# Altium schematic sheet MCU.SchDoc
size A3
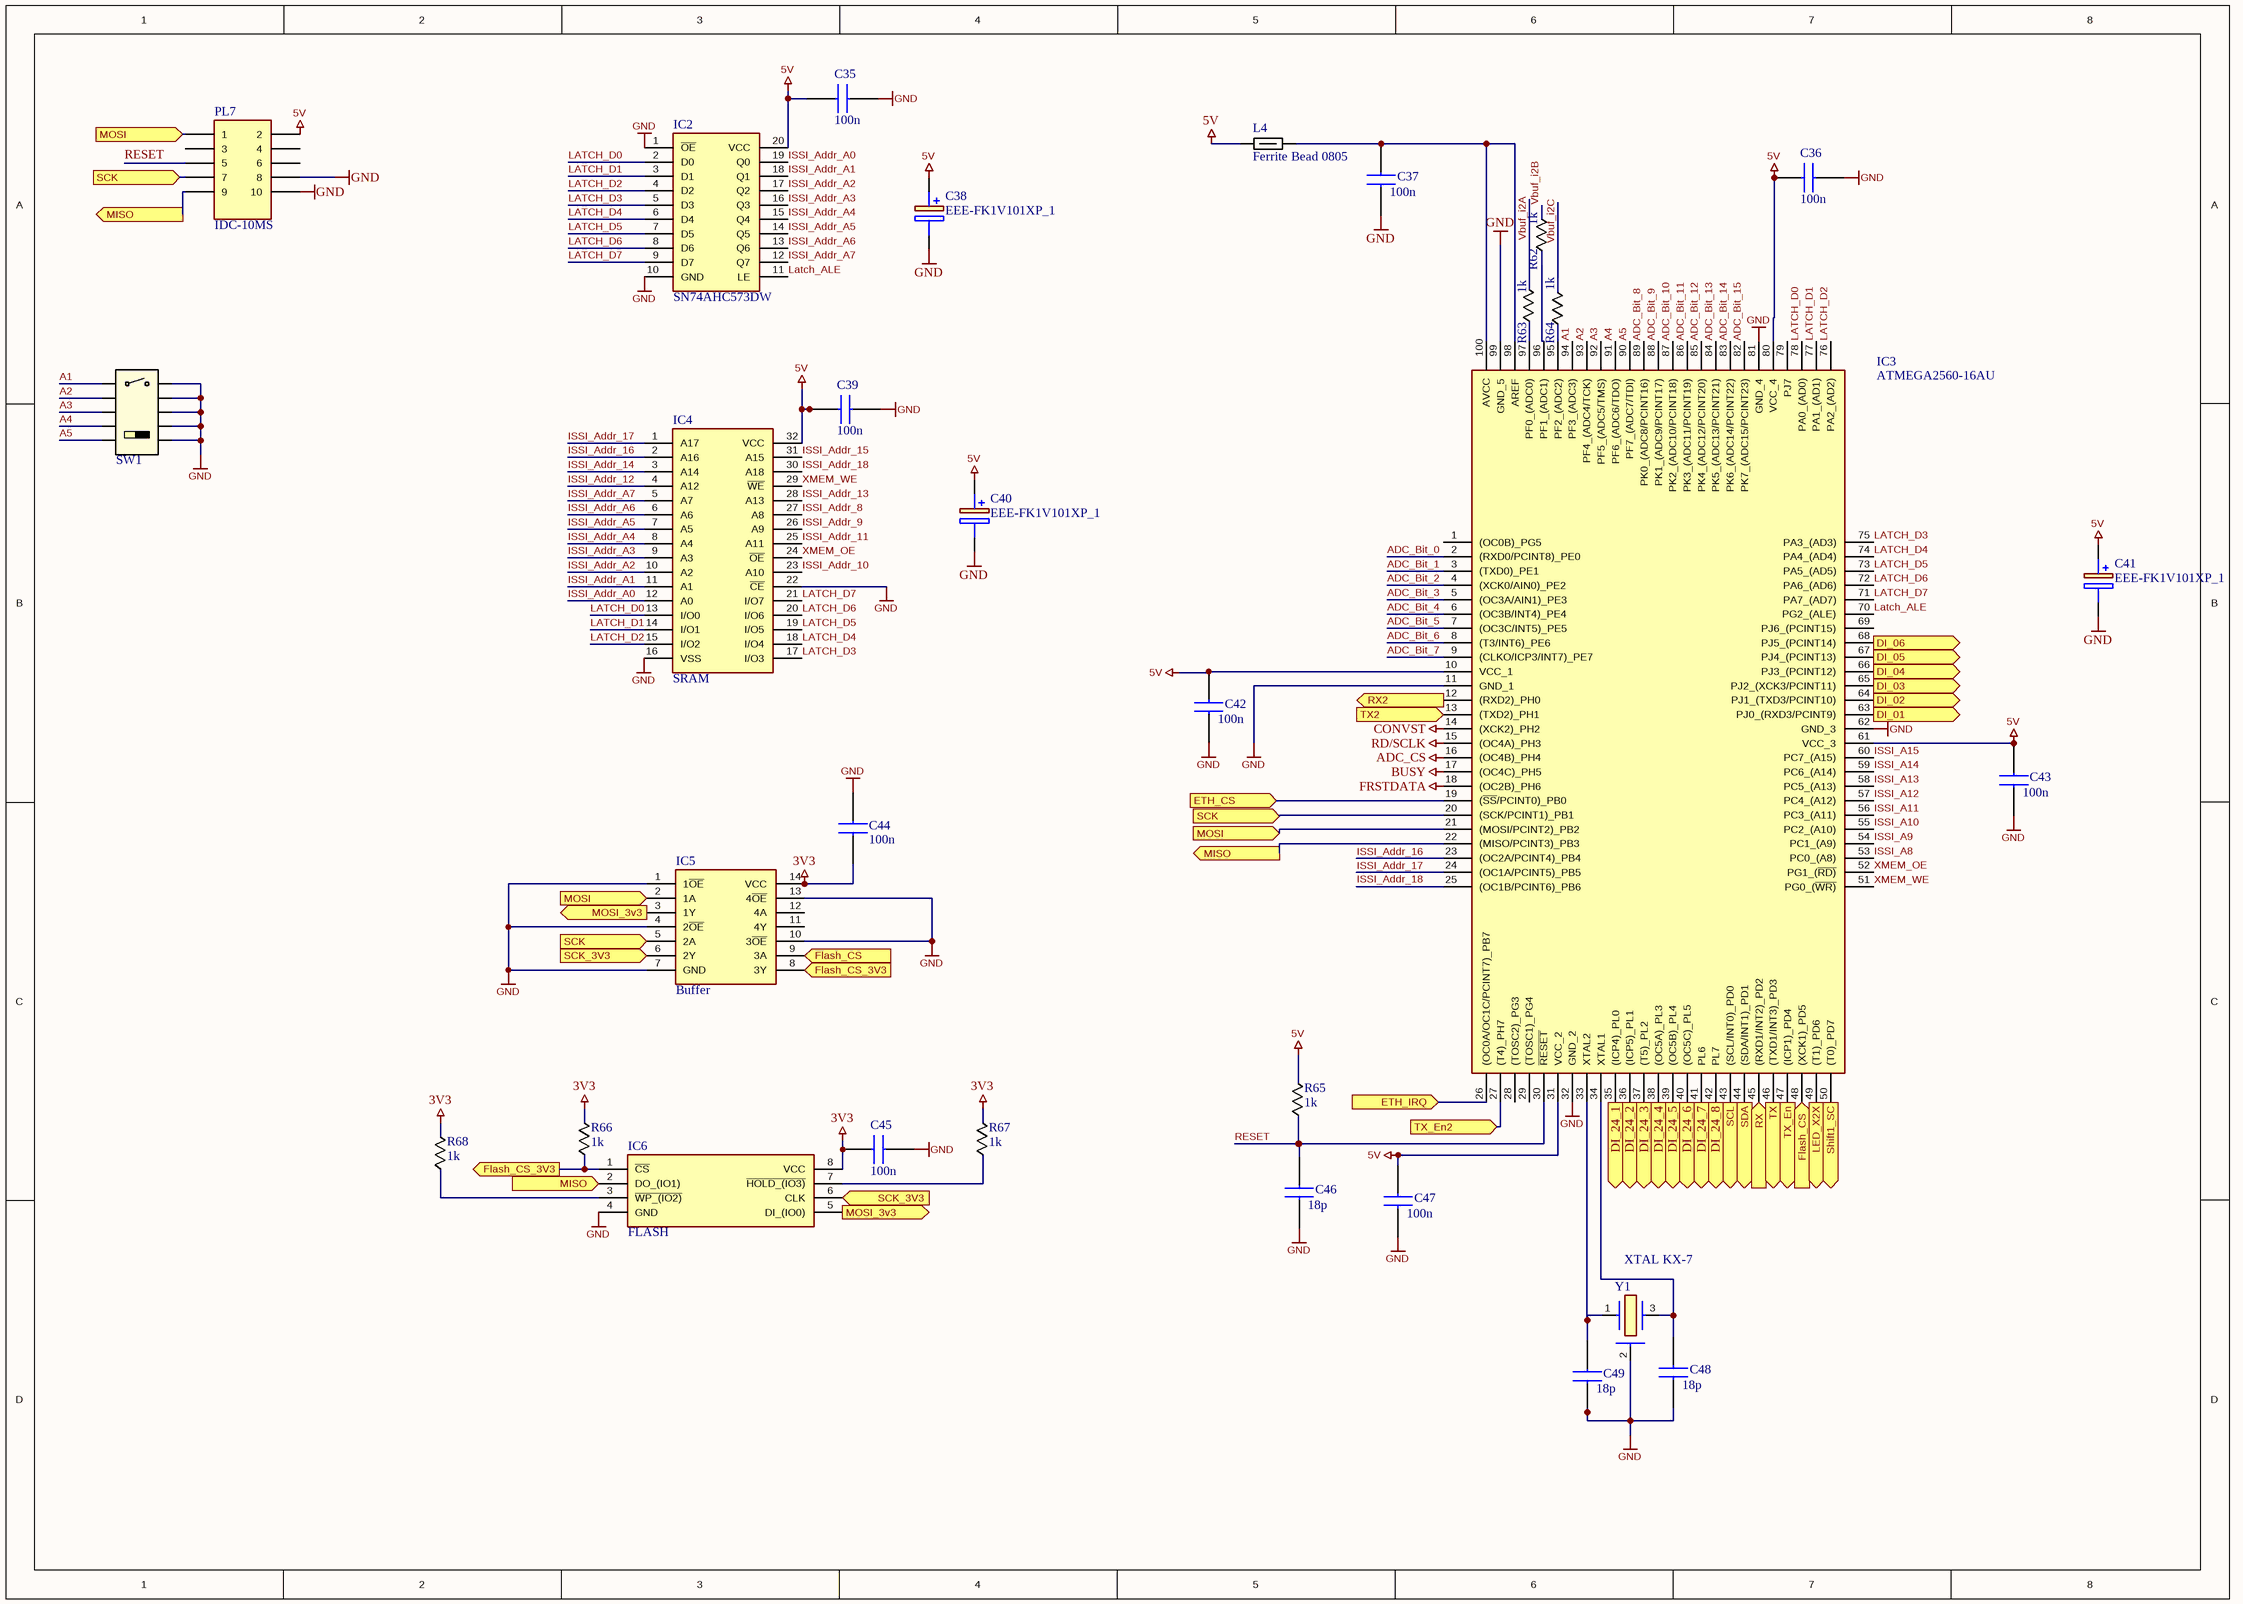
[diagram p0: MCU.SchDoc]

## Parts
C35  100n  [0603 CAP]
C36  100n  [0603 CAP]
C37  100n  [0603 CAP]
C38  EEE-FK1V101XP_1  [EEE1AA220WR]
C39  100n  [0603 CAP]
C40  EEE-FK1V101XP_1  [EEE1AA220WR]
C41  EEE-FK1V101XP_1  [EEE1AA220WR]
C42  100n  [0603 CAP]
C43  100n  [0603 CAP]
C44  100n  [0603 CAP]
C45  100n  [0603 CAP]
C46  18p  [0603 CAP]
C47  100n  [0603 CAP]
C48  18p  [0603 CAP]
C49  18p  [0603 CAP]
IC2  SN74AHC573DW  [SOIC-20N]
IC3  ATMEGA2560-16AU  [QFP-100N]
IC4  SRAM  [SOIC32]
IC5  Buffer  [SOP-14N]
IC6  FLASH  [SOIC-8]
L4  Ferrite Bead 0805  [BLM21AG102BH1J]
PL7  IDC-10MS  [DS101310SSIB1B0]
R62  1k  [0603 CAP]
R63  1k  [0603 CAP]
R64  1k  [0603 CAP]
R65  1k  [0603 CAP]
R66  1k  [0603 CAP]
R67  1k  [0603 CAP]
R68  1k  [0603 CAP]
SW1  DIP-Switch 5 Pins  [Switch DIP-5]  (value not drawn)
Y1  XTAL KX-7  [XTAL KX-7]

## Ports
DI_01, DI_02, DI_03, DI_04, DI_05, DI_06, DI_24_1, DI_24_2, DI_24_3, DI_24_4, DI_24_5, DI_24_6, DI_24_7, DI_24_8, ETH_CS, ETH_IRQ, Flash_CS, Flash_CS_3V3, LED_X2X, MISO, MOSI, MOSI_3v3, RX, RX2, SCK, SCK_3V3, SCL, SDA, Shift1_SC, TX, TX2, TX_En, TX_En2

## Nets
3V3: C44.1 C45.1 IC5.14(VCC) IC6.8(VCC) R66.2 R67.2 R68.2
5V: C35.2 C36.2 C38.1(+) C39.2 C40.1(+) C41.1(+) C42.2 C43.2 C47.2 IC2.20(VCC) IC3.10(VCC_1) IC3.31(VCC_2) IC3.61(VCC_3) IC3.80(VCC_4) IC4.32(VCC) L4.1 PL7.2 R65.2
ADC_CS: IC3.16((OC4B)_PH4)
BUSY: IC3.17((OC4C)_PH5)
CONVST: IC3.14((XCK2)_PH2)
FRSTDATA: IC3.18((OC2B)_PH6)
GND: C35.1 C36.1 C37.1 C38.2(-) C39.1 C40.2(-) C41.2(-) C42.1 C43.1 C44.2 C45.2 C46.1 C47.1 C48.1 C49.1 IC2.1(~{OE}) IC2.10(GND) IC3.11(GND_1) IC3.32(GND_2) IC3.62(GND_3) IC3.81(GND_4) IC3.99(GND_5) IC4.16(VSS) IC4.22(~{CE}) IC5.1(1~{OE}) IC5.4(2~{OE}) IC5.7(GND) IC5.10(3~{OE}) IC5.13(4~{OE}) IC6.4(GND) PL7.8 PL7.10 SW1.2 SW1.4 SW1.6 SW1.8 SW1.10 Y1.2
RD/SCLK: IC3.15((OC4A)_PH3)
A1: IC3.94(PF3_(ADC3)) SW1.1
A2: IC3.93(PF4_(ADC4/TCK)) SW1.3
A3: IC3.92(PF5_(ADC5/TMS)) SW1.5
A4: IC3.91(PF6_(ADC6/TDO)) SW1.7
A5: IC3.90(PF7_(ADC7/TDI)) SW1.9
ADC_Bit_0: IC3.2((RXD0/PCINT8)_PE0)
ADC_Bit_1: IC3.3((TXD0)_PE1)
ADC_Bit_2: IC3.4((XCK0/AIN0)_PE2)
ADC_Bit_3: IC3.5((OC3A/AIN1)_PE3)
ADC_Bit_4: IC3.6((OC3B/INT4)_PE4)
ADC_Bit_5: IC3.7((OC3C/INT5)_PE5)
ADC_Bit_6: IC3.8((T3/INT6)_PE6)
ADC_Bit_7: IC3.9((CLKO/ICP3/INT7)_PE7)
ADC_Bit_8: IC3.89(PK0_(ADC8/PCINT16))
ADC_Bit_9: IC3.88(PK1_(ADC9/PCINT17))
ADC_Bit_10: IC3.87(PK2_(ADC10/PCINT18))
ADC_Bit_11: IC3.86(PK3_(ADC11/PCINT19))
ADC_Bit_12: IC3.85(PK4_(ADC12/PCINT20))
ADC_Bit_13: IC3.84(PK5_(ADC13/PCINT21))
ADC_Bit_14: IC3.83(PK6_(ADC14/PCINT22))
ADC_Bit_15: IC3.82(PK7_(ADC15/PCINT23))
DI_01: IC3.63(PJ0_(RXD3/PCINT9)) ; port DI_01
DI_02: IC3.64(PJ1_(TXD3/PCINT10)) ; port DI_02
DI_03: IC3.65(PJ2_(XCK3/PCINT11)) ; port DI_03
DI_04: IC3.66(PJ3_(PCINT12)) ; port DI_04
DI_05: IC3.67(PJ4_(PCINT13)) ; port DI_05
DI_06: IC3.68(PJ5_(PCINT14)) ; port DI_06
DI_24_1: IC3.35((ICP4)_PL0) ; port DI_24_1
DI_24_2: IC3.36((ICP5)_PL1) ; port DI_24_2
DI_24_3: IC3.37((T5)_PL2) ; port DI_24_3
DI_24_4: IC3.38((OC5A)_PL3) ; port DI_24_4
DI_24_5: IC3.39((OC5B)_PL4) ; port DI_24_5
DI_24_6: IC3.40((OC5C)_PL5) ; port DI_24_6
DI_24_7: IC3.41(PL6) ; port DI_24_7
DI_24_8: IC3.42(PL7) ; port DI_24_8
ETH_CS: IC3.19((~{SS}/PCINT0)_PB0) ; port ETH_CS
ETH_IRQ: IC3.26((OC0A/OC1C/PCINT7)_PB7) ; port ETH_IRQ
Flash_CS: IC3.48((XCK1)_PD5) IC5.9(3A) ; port Flash_CS
Flash_CS_3V3: IC5.8(3Y) IC6.1(~{CS}) R66.1 ; port Flash_CS_3V3
ISSI_A8: IC3.53(PC0_(A8))
ISSI_A9: IC3.54(PC1_(A9))
ISSI_A10: IC3.55(PC2_(A10))
ISSI_A11: IC3.56(PC3_(A11))
ISSI_A12: IC3.57(PC4_(A12))
ISSI_A13: IC3.58(PC5_(A13))
ISSI_A14: IC3.59(PC6_(A14))
ISSI_A15: IC3.60(PC7_(A15))
ISSI_Addr_8: IC4.27(A8)
ISSI_Addr_9: IC4.26(A9)
ISSI_Addr_10: IC4.23(A10)
ISSI_Addr_11: IC4.25(A11)
ISSI_Addr_12: IC4.4(A12)
ISSI_Addr_13: IC4.28(A13)
ISSI_Addr_14: IC4.3(A14)
ISSI_Addr_15: IC4.31(A15)
ISSI_Addr_16: IC3.23((OC2A/PCINT4)_PB4) IC4.2(A16)
ISSI_Addr_17: IC3.24((OC1A/PCINT5)_PB5) IC4.1(A17)
ISSI_Addr_18: IC3.25((OC1B/PCINT6)_PB6) IC4.30(A18)
ISSI_Addr_A0: IC2.19(Q0) IC4.12(A0)
ISSI_Addr_A1: IC2.18(Q1) IC4.11(A1)
ISSI_Addr_A2: IC2.17(Q2) IC4.10(A2)
ISSI_Addr_A3: IC2.16(Q3) IC4.9(A3)
ISSI_Addr_A4: IC2.15(Q4) IC4.8(A4)
ISSI_Addr_A5: IC2.14(Q5) IC4.7(A5)
ISSI_Addr_A6: IC2.13(Q6) IC4.6(A6)
ISSI_Addr_A7: IC2.12(Q7) IC4.5(A7)
Latch_ALE: IC2.11(LE) IC3.70(PG2_(ALE))
LATCH_D0: IC2.2(D0) IC3.78(PA0_(AD0)) IC4.13(I/O0)
LATCH_D1: IC2.3(D1) IC3.77(PA1_(AD1)) IC4.14(I/O1)
LATCH_D2: IC2.4(D2) IC3.76(PA2_(AD2)) IC4.15(I/O2)
LATCH_D3: IC2.5(D3) IC3.75(PA3_(AD3)) IC4.17(I/O3)
LATCH_D4: IC2.6(D4) IC3.74(PA4_(AD4)) IC4.18(I/O4)
LATCH_D5: IC2.7(D5) IC3.73(PA5_(AD5)) IC4.19(I/O5)
LATCH_D6: IC2.8(D6) IC3.72(PA6_(AD6)) IC4.20(I/O6)
LATCH_D7: IC2.9(D7) IC3.71(PA7_(AD7)) IC4.21(I/O7)
LED_X2X: IC3.49((T1)_PD6) ; port LED_X2X
MISO: IC3.22((MISO/PCINT3)_PB3) IC6.2(DO_(IO1)) PL7.9 ; port MISO
MOSI: IC3.21((MOSI/PCINT2)_PB2) IC5.2(1A) PL7.1 ; port MOSI
MOSI_3v3: IC5.3(1Y) IC6.5(DI_(IO0)) ; port MOSI_3v3
RESET: C46.2 IC3.30(~{RESET}) PL7.5 R65.1
RX: IC3.45((RXD1/INT2)_PD2) ; port RX
RX2: IC3.12((RXD2)_PH0) ; port RX2
SCK: IC3.20((SCK/PCINT1)_PB1) IC5.5(2A) PL7.7 ; port SCK
SCK_3V3: IC5.6(2Y) IC6.6(CLK) ; port SCK_3V3
SCL: IC3.43((SCL/INT0)_PD0) ; port SCL
SDA: IC3.44((SDA/INT1)_PD1) ; port SDA
Shift1_SC: IC3.50((T0)_PD7) ; port Shift1_SC
TX: IC3.46((TXD1/INT3)_PD3) ; port TX
TX2: IC3.13((TXD2)_PH1) ; port TX2
TX_En: IC3.47((ICP1)_PD4) ; port TX_En
TX_En2: IC3.27((T4)_PH7) ; port TX_En2
Vbuf_i2A: R63.2
Vbuf_i2B: R62.2
Vbuf_i2C: R64.2
XMEM_OE: IC3.52(PG1_(~{RD)}) IC4.24(~{OE})
XMEM_WE: IC3.51(PG0_(~{WR)}) IC4.29(~{WE})
NetC37_2: C37.2 IC3.98(AREF) IC3.100(AVCC) L4.2
NetC48_2: C48.2 IC3.34(XTAL1) Y1.3
NetC49_2: C49.2 IC3.33(XTAL2) Y1.1
NetIC3_95: IC3.95(PF2_(ADC2)) R64.1
NetIC3_96: IC3.96(PF1_(ADC1)) R62.1
NetIC3_97: IC3.97(PF0_(ADC0)) R63.1
NetIC6_3: IC6.3(~{WP_(IO2)}) R68.1
NetIC6_7: IC6.7(~{HOLD_(IO3)}) R67.1

Not connected (* = marked no-connect by the designer): IC3 1((OC0B)_PG5) 28((TOSC2)_PG3) 29((TOSC1)_PG4) 69(PJ6_(PCINT15)) 79(PJ7); IC5 11(4Y) 12(4A); PL7 3 4 6

## Library data of the parts
C35-C37 C39 C42-C45 C47 = 0603 CAP: CC0603KRX7R9BB104; Manufacturer_Name: Murata Electronics; Manufacturer_Part_Number: GRM188R72A103KA01D; Datasheet Link: https://search.murata.co.jp/Ceramy/image/img/A01X/G101/ENG/GRM188R72A103KA01-01A.pdf; Height: 0.9mm; Mouser Part Number: 81-GRM188R72A103KA1D; Mouser Price/Stock: https://www.mouser.co.uk/ProductDetail/Murata-Electronics/GRM188R72A103KA01D?qs=krk%2F6UQjCzAtl9phuocbug%3D%3D; Arrow Part Number: GRM188R72A103KA01D; Arrow Price/Stock: https://www.arrow.com/en/products/grm188r72a103ka01d/murata-manufacturing?region=europe
C38 C40 C41 = EEE-FK1V101XP_1: EEEFK1C100R; Manufacturer_Name: Panasonic; Datasheet Link: http://industrial.panasonic.com/cdbs/www-data/pdf/RDE0000/ABA0000C1181.pdf; Height: 7.8mm; Manufacturer_Part_Number: EEE-FK1V101XP; Mouser Part Number: 667-EEE-FK1V101XP; Mouser Price/Stock: https://www.mouser.co.uk/ProductDetail/Panasonic/EEE-FK1V101XP?qs=qE6bgDGEOCu46KIpIgG5Yw%3D%3D; Arrow Part Number: EEE-FK1V101XP; Arrow Price/Stock: https://www.arrow.com/en/products/eee-fk1v101xp/panasonic?utm_currency=USD&region=europe
C46 C48 C49 = 0603 CAP: CC0603JRNPO9BN180; Manufacturer_Name: Murata Electronics; Manufacturer_Part_Number: GRM188R72A103KA01D; Datasheet Link: https://search.murata.co.jp/Ceramy/image/img/A01X/G101/ENG/GRM188R72A103KA01-01A.pdf; Height: 0.9mm; Mouser Part Number: 81-GRM188R72A103KA1D; Mouser Price/Stock: https://www.mouser.co.uk/ProductDetail/Murata-Electronics/GRM188R72A103KA01D?qs=krk%2F6UQjCzAtl9phuocbug%3D%3D; Arrow Part Number: GRM188R72A103KA01D; Arrow Price/Stock: https://www.arrow.com/en/products/grm188r72a103ka01d/murata-manufacturing?region=europe
IC2 = 74HC573D,653: Integrated Circuit; Manufacturer_Name: Nexperia; Datasheet Link: https://assets.nexperia.com/documents/data-sheet/74HC_HCT573.pdf; Height: 2.65mm; Manufacturer_Part_Number: 74HC573D,653; Mouser Part Number: 771-74HC573D-T; Mouser Price/Stock: https://www.mouser.co.uk/ProductDetail/Nexperia/74HC573D653?qs=P62ublwmbi8WfKX2wZR8SA%3D%3D; Arrow Part Number: 74HC573D,653; Arrow Price/Stock: https://www.arrow.com/en/products/74hc573d653/nexperia?utm_currency=USD&region=europe
IC3 = ATMEGA2560-16AU: Integrated Circuit; Manufacturer_Name: Microchip; Datasheet Link: https://datasheet.datasheetarchive.com/originals/distributors/Datasheets_SAMA/4a5a397fa76c39b5297f4121ace1d84e.pdf; Height: 1.2mm; Manufacturer_Part_Number: ATMEGA2560-16AU; Mouser Part Number: 556-ATMEGA2560-16AU; Mouser Price/Stock: https://www.mouser.co.uk/ProductDetail/Microchip-Technology/ATMEGA2560-16AU?qs=aqrrBurbvGciYmlAokFS0w%3D%3D; Arrow Part Number: ATMEGA2560-16AU; Arrow Price/Stock: null?region=nac
IC4 = CY62148ELL-55SXI: Manufacturer_Name: Infineon; Datasheet Link: https://componentsearchengine.com/Datasheets/2/CY62148ELL-55SXI.pdf; Height: 2.997mm; Manufacturer_Part_Number: CY62148ELL-55SXI; Mouser Part Number: 727-CY62148ELL-55SXI; Mouser Price/Stock: https://www.mouser.co.uk/ProductDetail/Cypress-Semiconductor/CY62148ELL-55SXI?qs=k2piNBSag3%252BZl%2FeQyEY%2FXw%3D%3D; Arrow Part Number: CY62148ELL-55SXI; Arrow Price/Stock: https://www.arrow.com/en/products/cy62148ell-55sxi/cypress-semiconductor
IC5 = 74LVC125APW,118: Manufacturer_Name: Nexperia; Datasheet Link: https://assets.nexperia.com/documents/data-sheet/74LVC125A.pdf; Height: 1.1mm; Manufacturer_Part_Number: 74LVC125APW,118; Mouser Part Number: 771-74LVC125APW-T; Mouser Price/Stock: https://www.mouser.co.uk/ProductDetail/Nexperia/74LVC125APW118?qs=me8TqzrmIYV8VAZOS5KVLw%3D%3D; Arrow Part Number: 74LVC125APW,118; Arrow Price/Stock: https://www.arrow.com/en/products/74lvc125apw118/nexperia?utm_currency=USD&region=nac
IC6 = W25Q64FVSSIG: Manufacturer_Name: Winbond; Datasheet Link: https://www.winbond.com/resource-files/w25q64fv revq 06142016.pdf; Height: 2.16mm; Manufacturer_Part_Number: W25Q64FVSSIG; Mouser Part Number: N/A; Mouser Price/Stock: https://www.mouser.co.uk/ProductDetail/Winbond/W25Q64FVSSIG?qs=rkhjVJ6%2F3EIyeN0wt4XchA%3D%3D; Arrow Part Number: W25Q64FVSSIG; Arrow Price/Stock: https://www.arrow.com/en/products/w25q64fvssig/winbond-electronics
L4 = Ferrite Bead
PL7 = IDC-10MS: DS1013-10SSiB1-B-0
R62-R68 = 0603 RES
SW1 = Switch DIP-5: DIP-Switch NDP-05
Y1 = XTAL KX-7: Crystal or Oscillator; Manufacturer_Name: NDK; Manufacturer_Part_Number: NX3215SA-32.768K-STD-MUA-14; Datasheet Link: https://www.mouser.com/datasheet/2/905/c_NX3215SA-STD-MUA-14_e-1317539.pdf; Height: 0.9mm; Mouser Part Number: 344-NX3215SA32768K14; Mouser Price/Stock: https://www.mouser.co.uk/ProductDetail/NDK/NX3215SA-32.768K-STD-MUA-14?qs=55YtniHzbhCTyKGENMTVrQ%3D%3D